# Altium project Wenzel_REF.PrjPCB (part 2 of 7)

## Sheet Clock_Generator_Divider.SchDoc: =SheetTitle_Top
size 420 x 297 mm; Author: G.Kasprowicz; CompanyName: WUT ISE; DrawnBy: G.Kasprowicz; Organization: WUT ISE; Address1: PW ISE; Address2: Nowowiejska 15/19 00-665 Warsaw; Address3: gkasprow@gmail.com; Revision: 1.1; ModifiedBy: -; CheckedDate: -; Title2: Clock generator & Divider; DivGrp: WUT ISE; Designer: G.Kasprowicz; ModifiedDate: -; ProjectName: Sensor Box
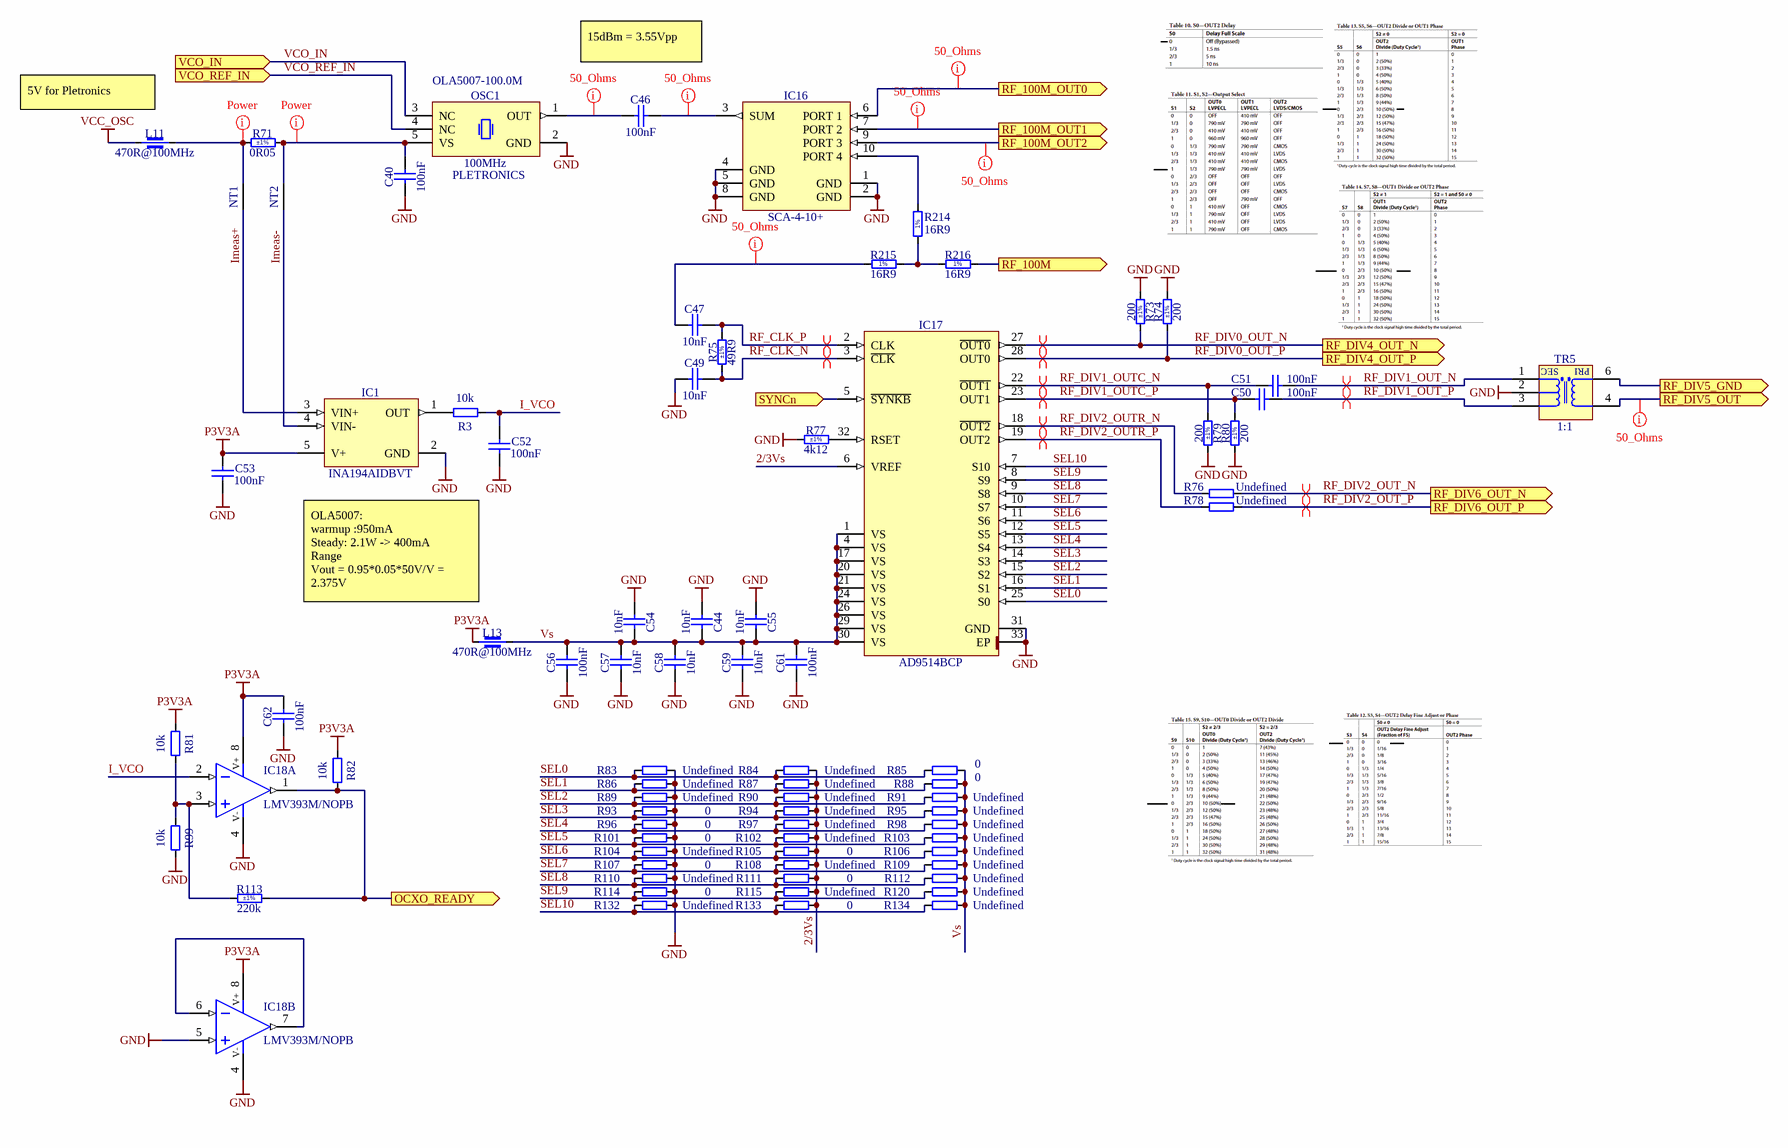
[diagram p3: Clock_Generator_Divider.SchDoc]

### Parts
(Parts that share a designator on the sheet are numbered #1, #2 ... from top to bottom, then left to right.)
C40  100nF  [CAPC1005X55N]
C44  10nF  [CAPC1005X55N]
C46  100nF  [CAPC1005X55N]
C47  10nF  [CAPC1005X55N]
C49  10nF  [CAPC1005X55N]
C50  100nF  [CAPC1005X55N]
C51  100nF  [CAPC1005X55N]
C52  100nF  [CAPC1005X55N]
C53  100nF  [CAPC1005X55N]
C54  10nF  [CAPC1005X55N]
C55  10nF  [CAPC1005X55N]
C56  100nF  [CAPC1005X55N]
C57  10nF  [CAPC1005X55N]
C58  10nF  [CAPC1005X55N]
C59  10nF  [CAPC1005X55N]
C61  100nF  [CAPC1005X55N]
C62  100nF  [CAPC1005X55N]
IC1  INA194AIDBVT  [SOT95P280X145-5N]
IC16  SCA-4-10+  [MINI-CIRCUITS_DZ943]
IC17  AD9514BCP  [QFN50P500X500X100-33N-S325]
IC18  LMV393M/NOPB  [SOIC127P600X175-8N]  (parts A,B of 2)
L11  470R@100MHz  [INDC1608X95N]
L13  470R@100MHz  [INDC1608X95N]
NT1  Net Tie  [Net Tie]  (value not drawn)  (net tie, no BOM)
NT2  Net Tie  [Net Tie]  (value not drawn)  (net tie, no BOM)
OSC1  100MHz  Manufacturer: PLETRONICS  Manufacturer Part Number: OLA5007-100.0M  [OSC_PLETRONICS_OLA5]
R3  10k  [RESC1608X55N]
R71  0R05  Tolerance: ±1%  [RESC2012X60N]
R73  200  Tolerance: ±1%  [RESC1005X40N]
R74  200  Tolerance: ±1%  [RESC1005X40N]
R75  49R9  Tolerance: ±1%  [RESC1005X40N]
R76  Undefined  [RESC1608X55N]
R77  4k12  Tolerance: ±1%  [RESC1005X40N]
R78  Undefined  [RESC1608X55N]
R79  200  Tolerance: ±1%  [RESC1005X40N]
R80  200  Tolerance: ±1%  [RESC1005X40N]
R81  10k  [RESC1608X55N]
R82  10k  [RESC1608X55N]
R83  Undefined  [RESC1608X55N]
R84  Undefined  [RESC1608X55N]
R85  0  [RESC1608X55N]
R86  Undefined  [RESC1608X55N]
R87  Undefined  [RESC1608X55N]
R88  0  [RESC1608X55N]
R89  Undefined  [RESC1608X55N]
R90  Undefined  [RESC1608X55N]
R91  Undefined  [RESC1608X55N]
R93  0  [RESC1608X55N]
R94  Undefined  [RESC1608X55N]
R95  Undefined  [RESC1608X55N]
R96  0  [RESC1608X55N]
R97  Undefined  [RESC1608X55N]
R98  Undefined  [RESC1608X55N]
R99  10k  [RESC1608X55N]
R101  0  [RESC1608X55N]
R102  Undefined  [RESC1608X55N]
R103  Undefined  [RESC1608X55N]
R104  Undefined  [RESC1608X55N]
R105  0  [RESC1608X55N]
R106  Undefined  [RESC1608X55N]
R107  0  [RESC1608X55N]
R108  Undefined  [RESC1608X55N]
R109  Undefined  [RESC1608X55N]
R110  Undefined  [RESC1608X55N]
R111  0  [RESC1608X55N]
R112  Undefined  [RESC1608X55N]
R113  220k  Tolerance: ±1%  [RESC1005X40N]
R114  0  [RESC1608X55N]
R115  Undefined  [RESC1608X55N]
R120  Undefined  [RESC1608X55N]
R132  Undefined  [RESC1608X55N]
R133  0  [RESC1608X55N]
R134  Undefined  [RESC1608X55N]
R214#1  16R9  [RESC1005X40N]
R215#1  16R9  [RESC1005X40N]
R216#1  16R9  [RESC1005X40N]
TR5  1:1  [XFMR_MINI-CIRCUITS_AT1521]

### Ports
OCXO_READY (out), RF_100M (out), RF_100M_OUT0 (out), RF_100M_OUT1 (out), RF_100M_OUT2 (out), RF_DIV4_OUT_N (out), RF_DIV4_OUT_P (out), RF_DIV5_GND (out), RF_DIV5_OUT (out), RF_DIV6_OUT_N (out), RF_DIV6_OUT_P (out), SYNCn (in), VCO_IN (in), VCO_REF_IN (in)

### Nets
GND: C40.1 C44.1 C49.1 C52.1 C53.1 C54.1 C55.1 C56.1 C57.1 C58.1 C59.1 C61.1 C62.1 IC1.2(GND) IC16.1(GND) IC16.2(GND) IC16.4(GND) IC16.5(GND) IC16.8(GND) IC17.31(GND) IC17.33(EP) IC18.4(V-) IC18.5(IN+) OSC1.2(GND) R73.1 R74.2 R77.1 R79.2 R80.1 R83.2 R86.2 R89.2 R93.2 R96.2 R99.2 R101.2 R104.2 R107.2 R110.2 R114.2 R132.2 TR5.2(NC)
P3V3A: C53.2 C62.2 IC1.5(V+) IC18.8(V+) L13.1 R81.1 R82.1
VCC_OSC: L11.1
2/3Vs: IC17.6(VREF) R84.2 R87.2 R90.2 R94.2 R97.2 R102.2 R105.2 R108.2 R111.2 R115.2 R133.2
D2: IC17.5(~{SYNKB}) ; port SYNCn
D3: IC18.1(OUT) R82.2 R113.2 ; port OCXO_READY
I_VCO: C52.2 IC18.2(IN-) R3.1
Imeas+: IC1.3(VIN+) NT1.1
Imeas-: IC1.4(VIN-) NT2.1
RF_100M: R216#1.2 ; port RF_100M
RF_100M_OUT0: IC16.6(PORT_1) ; port RF_100M_OUT0
RF_100M_OUT1: IC16.7(PORT_2) ; port RF_100M_OUT1
RF_100M_OUT2: IC16.9(PORT_3) ; port RF_100M_OUT2
RF_CLK_N: C49.2 IC17.3(~{CLK}) R75.1
RF_CLK_P: C47.2 IC17.2(CLK) R75.2
RF_DIV0_OUT_N: IC17.27(~{OUT0}) R73.2 ; port RF_DIV4_OUT_N  [project net IN_CLK0_N]
RF_DIV0_OUT_P: IC17.28(OUT0) R74.1 ; port RF_DIV4_OUT_P  [project net IN_CLK0_P]
RF_DIV1_OUT_N: C51.1 TR5.1(SDOT)
RF_DIV1_OUT_P: C50.1 TR5.3(S)
RF_DIV1_OUTC_N: C51.2 IC17.22(~{OUT1}) R79.1
RF_DIV1_OUTC_P: C50.2 IC17.23(OUT1) R80.2
RF_DIV2_OUT_N: R76.2 ; port RF_DIV6_OUT_N  [project net EEM_IO.LVDS_N0]
RF_DIV2_OUT_P: R78.2 ; port RF_DIV6_OUT_P  [project net EEM_IO.LVDS_P0]
RF_DIV2_OUTR_N: IC17.18(~{OUT2}) R76.1
RF_DIV2_OUTR_P: IC17.19(OUT2) R78.1
RF_DIV5_GND: TR5.6(PDOT) ; port RF_DIV5_GND
RF_DIV5_OUT: TR5.4(P) ; port RF_DIV5_OUT
SEL0: IC17.25(S0) R83.1 R84.1 R85.1
SEL1: IC17.16(S1) R86.1 R87.1 R88.1
SEL2: IC17.15(S2) R89.1 R90.1 R91.1
SEL3: IC17.14(S3) R93.1 R94.1 R95.1
SEL4: IC17.13(S4) R96.1 R97.1 R98.1
SEL5: IC17.12(S5) R101.1 R102.1 R103.1
SEL6: IC17.11(S6) R104.1 R105.1 R106.1
SEL7: IC17.10(S7) R107.1 R108.1 R109.1
SEL8: IC17.9(S8) R110.1 R111.1 R112.1
SEL9: IC17.8(S9) R114.1 R115.1 R120.1
SEL10: IC17.7(S10) R132.1 R133.1 R134.1
VCO_IN: OSC1.3(NC) ; port VCO_IN
VCO_REF_IN: OSC1.4(NC) ; port VCO_REF_IN
Vs: C44.2 C54.2 C55.2 C56.2 C57.2 C58.2 C59.2 C61.2 IC17.1(VS) IC17.4(VS) IC17.17(VS) IC17.20(VS) IC17.21(VS) IC17.24(VS) IC17.26(VS) IC17.29(VS) IC17.30(VS) L13.2 R85.2 R88.2 R91.2 R95.2 R98.2 R103.2 R106.2 R109.2 R112.2 R120.2 R134.2
NetC40_2: C40.2 NT2.2 OSC1.5(VS) R71.2
NetC46_1: C46.1 OSC1.1(OUT)
NetC46_2: C46.2 IC16.3(SUM)
NetC47_1: C47.1 R215#1.1
NetIC1_1: IC1.1(OUT) R3.2
NetIC16_10: IC16.10(PORT_4) R214#1.2
NetIC17_32: IC17.32(RSET) R77.2
NetIC18_3: IC18.3(IN+) R81.2 R99.1 R113.1
NetIC18_6: IC18.6(IN-) IC18.7(OUT)
NetL11_2: L11.2 NT1.2 R71.1
NetR214#1_1: R214#1.1 R215#1.2 R216#1.1

### Layout directives
net class 50_Ohms: NetC46_1, NetC46_2, NetC47_1, RF_100M_OUT0, RF_100M_OUT1, RF_100M_OUT2, RF_DIV5_OUT
net class Power: NetC40_2, NetL11_2
differential pair: EEM_IO.LVDS_N0, EEM_IO.LVDS_P0, IN_CLK0_N, IN_CLK0_P, RF_CLK_N, RF_CLK_P, RF_DIV1_OUT_N, RF_DIV1_OUT_P, RF_DIV1_OUTC_N, RF_DIV1_OUTC_P, RF_DIV2_OUTR_N, RF_DIV2_OUTR_P

### Notes on the sheet
- 15dBm = 3.55Vpp
- (near L11) 5V for Pletronics
- OLA5007:
  warmup :950mA
  Steady: 2.1W -> 400mA
  Range
  Vout = 0.95*0.05*50V/V = 2.375V
- Project/Equipment
- Document
- Designer
- Drawn by
- Check.by
- Copyright WUT ISE 2020.
  This documentation describes Open Hardware and is licensed under the CERN OHL v.1.2. You may redistribute and modify this documentation under the terms of the CERN OHL v.1.2. (http://ohwr.org/CERNOHL). This documentation is distributed WITHOUT ANY EXPRESS OR IMPLIED WARRANTY, INCLUDING OF MERCHANTABILITY, SATISFACTORY QUALITY AND FITNESS FOR A PARTICULAR PURPOSE. Please see the CERN OHL v.1.2 for applicable conditions.
- Contact
- File
- Last Mod.
- Print Date
- Sheet
- Size
- A3
- of
- Rev
- (in symbol R0402_16R9_1%_0.0625W_100PPM) 1%
- (in symbol XFMR_MINI-CIRCUITS_TC2-1TX+) SEC; PRI

### Library data of the parts
C40 C46 C50-C53 C56 C61 C62 = CC0402_100NF_16V_10%_X5R: as C41 on sheet Drivers; Part Number: CC0402_100NF_16V_10%_X5R; Component Kind: Standard; Component Type: Standard; Pin Count: 2; Value: 100nF; Status: None; Manufacturer Part Number: CC0402_100NF_16V_10%_X5R; Case: 0402; Mounted: Yes; Socket: No; SMD: Yes; Sense: No; Manufacturer1 Example: MURATA; Manufacturer1 ComponentHeight: 0.55mm; HelpURL: \\cern.ch\dfs\Applications\Altium\Datasheets\CC0402_X5R_MURATA_GRM.pdf; Author: CERN DEM JLC; CreateDate: 10.12.2013; LatestRevisionDate: 10.12.2013
C44 C47 C49 C54 C55 C57-C59 = CC0402_10NF_16V_10%_X7R: as C140#1 on sheet Wenzel_REF; Part Number: CC0402_10NF_16V_10%_X7R; Component Kind: Standard; Component Type: Standard; Pin Count: 2; Value: 10nF; Status: Not Recommended; Manufacturer Part Number: CC0402_10NF_16V_10%_X7R; Case: 0402; Mounted: Yes; Socket: No; SMD: Yes; Sense: No; Manufacturer1 Example: PHYCOMP; Manufacturer1 ComponentHeight: 0.55mm; HelpURL: \\cern.ch\dfs\Applications\Altium\Datasheets\CC0402_X7R_PHYCOMP.pdf; Author: CERN DEM JLC; CreateDate: 03.12.2007; LatestRevisionDate: 03.12.2007
IC1 = INA194AIDBVT: Current Shunt Monitor -16V to +80V Common-Mode Range; Manufacturer: TEXAS INSTRUMENTS; PressFit: No; Bonding: No; Part Number: INA194AIDBVT; Component Kind: Standard; Component Type: Standard; Device: INA194AIDBVT; PackageDescription: SOT, 0.95mm pitch; 5 pin, 1.60mm W X 2.90mm L X 1.45mm H body, IPC Medium Density; Part Description: Current Shunt Monitor -16V to +80V Common-Mode Range; Manufacturer Part Number: INA194AIDBVT; Pin Count: 5; Case: SOT23-5; Mounted: Yes; Socket: No; SMD: Yes; Sense: No; ComponentHeight: 1.45mm; Author: CERN DEM JLC; HelpURL: \\cern.ch\dfs\Applications\Altium\Datasheets\INA194AIDBVT.pdf; CreateDate: 10.05.2010; LatestRevisionDate: 10.05.2010
IC16 = SCA-4-10+: 4 Way-0°, 50 Ohms, 5 to 1000MHz, Power Splitter/Combiner; Manufacturer: MINI-CIRCUITS; PressFit: No; Bonding: No; Part Number: SCA-4-10+; Component Kind: Standard; Component Type: Standard; Device: SCA-4-10+; PackageDescription: MINI-CIRCUITS TDZ943 Case, 10 Pin,  7.62mm W X 6.35mm L; Part Description: 4 Way-0°, 50 Ohms, 5 to 1000MHz, Power Splitter/Combiner; Manufacturer Part Number: SCA-4-10; Pin Count: 10; Mounted: Yes; Socket: No; SMD: Yes; Sense: No; ComponentHeight: 5.84mm; Author: CERN DEM JLC; HelpURL: \\cern.ch\dfs\Applications\Altium\Datasheets\SCA-4-10+.pdf; CreateDate: 03.11.2009; LatestRevisionDate: 09.06.2022
IC17 = AD9514BCP: 1.600 MHz Clock distribution IC, dividers, Delay Adjust, Three Outputs; Part Description: 1.6 GHz Clock Distribution IC, dividers, Delay Adjust, three Outputs; Manufacturer: ANALOG DEVICES; PressFit: No; Bonding: No; Part Number: AD9514BCP; Component Kind: Standard; Component Type: Standard; Device: AD9514BCP; PackageDescription: QFN, (MO-220-VHHD-2) 0.50mm Pitch, Square; 32 Pin, 5.00mm L X 5.00mm W X 1.00mm H body (w/Thermal Tab 3.25 X 3.25mm), IPC Medium Density; Manufacturer Part Number: AD9514BCP; Pin Count: 33; Case: QFN32; Mounted: Yes; Socket: No; SMD: Yes; Sense: No; ComponentHeight: 1mm; HelpURL: \\cern.ch\dfs\Applications\Altium\Datasheets\AD9514BCP.pdf; Author: CERN DEM HF; CreateDate: 20.12.2023; LatestRevisionDate: 20.12.2023
IC18 = LMV393M/NOPB: Dual Operational Amplifier; Part Description: Dual General Purpose, Low Voltage, Tiny Pack Comparator; Manufacturer: TEXAS INSTRUMENTS; PressFit: No; Bonding: No; Part Number: LMV393M/NOPB; Component Kind: Standard; Component Type: Standard; Device: LMV393M/NOPB; PackageDescription: SOIC 8, Pitch 1.27mm - Body 4x5mm, IPC Medium Density; Manufacturer Part Number: LMV393M; Pin Count: 8; Case: SOIC8; Mounted: Yes; Socket: No; SMD: Yes; Sense: No; ComponentHeight: 1.75mm; Author: CERN DEM JLC; HelpURL: \\cern.ch\dfs\Applications\Altium\Datasheets\LMV393M-NOPB.pdf; CreateDate: 29.11.2012; LatestRevisionDate: 01.06.2022
L11 L13 = IND0603_MURATA_BLM18PG471SN1D: as L9 on sheet Clock_fanout; Part Number: IND0603_MURATA_BLM18PG471SN1D; Component Kind: Standard; Component Type: Standard; Pin Count: 2; Value: 470R@100MHz; Manufacturer Part Number: BLM18PG471SN1D; Case: 0603; Mounted: Yes; Socket: No; SMD: Yes; Sense: No; ComponentHeight: 0.95mm; HelpURL: \\cern.ch\dfs\Applications\Altium\Datasheets\IND0603_MURATA_BLM18P.pdf; Author: CERN DEM BC; CreateDate: 17.02.2021; LatestRevisionDate: 17.02.2021
NT1 NT2 = Net Tie: Part Description: Net Tie (2 Nets); Mounted: No; Part Number: Net Tie; Component Type: Net Tie; Pin Count: 2; Family: Net Tie; Socket: No; SMD: No; Sense: No; Status: None; ComponentHeight: 0mm; HelpURL: Undefined; Author: CERN DEM JLC; CreateDate: 22.03.2011; LatestRevisionDate: 22.03.2011; PackageDescription: 2 Plated Through Hole For Coaxial Cable Link: Hole Dia.=1.4mm Pad Dia.=2.5mm
OSC1 = OSC_100MHZ_PLETRONICS_OLA5007-100.0M: 12V ±0.05ppm Oven Controlled Crystal Oscillator OCXO; Part Description: 5V, Stability: ±50ppb, -40°C to +85°C, Ultra Low Phase Noise OCXO, OLA5 Series; PressFit: No; Bonding: No; Part Number: OSC_100MHZ_PLETRONICS_OLA5007-100.0M; Component Kind: Standard; Component Type: Standard; PackageDescription: Oscillator, 9.525mm Pitch; 5 Pin, 25.78mm L X 25.78mm W X 12.70mm H, OLA5 Series; Value: 100MHz; Pin Count: 5; Mounted: Yes; Socket: No; SMD: No; Sense: No; ComponentHeight: 12.7mm; HelpURL: \\cern.ch\dfs\Applications\Altium\Datasheets\OSC_PLETRONICS_OLA5.pdf; Author: CERN DEM HF; CreateDate: 21.12.2023; LatestRevisionDate: 21.12.2023
R3 R81 R82 R99 = R0603_10K_1%_0.1W_100PPM: Resistor - 1%; Part Description: General Purpose Thick Film Chip Resistor; Manufacturer: GENERIC; Manufacturer1 Part Number: NRC06F1002TRF; Power: 0.1W; TC: ±100ppm/°C; PressFit: No; Part Number: R0603_10K_1%_0.1W_100PPM; Component Kind: Standard; Component Type: Standard; Pin Count: 2; Value: 10k; Status: Preferred; Tolerance: ±1%; Manufacturer Part Number: R0603_10K_1%_0.1W_100PPM; Case: 0603; Mounted: Yes; Sense: No; Socket: No; SMD: Yes; Manufacturer1 Example: NIC COMPONENT; Manufacturer1 ComponentHeight: 0.55mm; HelpURL: \\cern.ch\dfs\Applications\Altium\Datasheets\R0603_NIC_NRC.pdf; Author: CERN DEM JLC; CreateDate: 03.12.2007; LatestRevisionDate: 13.03.2008
R71 = R0805_0R05_1%_0.25W_300PPM: Resistor - 1%; Part Description: Low Resistance Thick Film Chip Resistor; Manufacturer: GENERIC; Manufacturer1 Part Number: 235051117500L or RL0805FR-7W0R05L; Power: 0.25W; TC: ±300ppm/°C; PressFit: No; Part Number: R0805_0R05_1%_0.25W_300PPM; Component Kind: Standard; Component Type: Standard; Pin Count: 2; Value: 0R05; Status: Not Recommended; Manufacturer Part Number: R0805_0R05_1%_0.25W_300PPM; Case: 0805; Mounted: Yes; Sense: No; Socket: No; SMD: Yes; Manufacturer1 Example: YAGEO PHYCOMP; Manufacturer1 ComponentHeight: 0.60mm; HelpURL: \\cern.ch\dfs\Applications\Altium\Datasheets\R0805_Phycomp_RL0805.pdf; Author: CERN DEM MR; CreateDate: 31.03.2016; LatestRevisionDate: 31.03.2016
R73 R74 R79 R80 = R0402_200R_1%_0.0625W_100PPM: as R92 on sheet Wenzel_REF; Part Number: R0402_200R_1%_0.0625W_100PPM; Component Kind: Standard; Component Type: Standard; Pin Count: 2; Value: 200; Status: Not Recommended; Power: 0.0625W; Manufacturer Part Number: R0402_200R_1%_0.0625W_100PPM; Case: 0402; Mounted: Yes; Sense: No; Socket: No; SMD: Yes; Manufacturer1 Example: YAGEO PHYCOMP; Manufacturer1 ComponentHeight: 0.4mm; HelpURL: \\cern.ch\dfs\Applications\Altium\Datasheets\R0402_Phycomp_RC0402.pdf; Author: CERN DEM JLC; CreateDate: 03.12.2007; LatestRevisionDate: 17.10.2012
R75 = R0402_49R9_1%_0.0625W_100PPM: Resistor - 1%; Part Description: General Purpose Thick Film Chip Resistor; Manufacturer: GENERIC; Manufacturer1 Part Number: 232270674999L or RC0402FR-0749R9L; TC: ±100ppm/°C; PressFit: No; Part Number: R0402_49R9_1%_0.0625W_100PPM; Component Kind: Standard; Component Type: Standard; Pin Count: 2; Value: 49R9; Status: Not Recommended; Power: 0.0625W; Manufacturer Part Number: R0402_49R9_1%_0.0625W_100PPM; Case: 0402; Mounted: Yes; Sense: No; Socket: No; SMD: Yes; Manufacturer1 Example: YAGEO PHYCOMP; Manufacturer1 ComponentHeight: 0.4mm; HelpURL: \\cern.ch\dfs\Applications\Altium\Datasheets\R0402_Phycomp_RC0402.pdf; Author: CERN DEM JLC; CreateDate: 24.10.2012; LatestRevisionDate: 24.10.2012
R76 R78 R83 R84 R86 R87 R89-R91 R94 R95 R97 R98 R102-R104 R106 R108-R110 R112 R115 R120 R132 R134 = R0603_NO-VALUE: as R168 on sheet Wenzel_REF; Part Number: R0603_NO-VALUE; Component Kind: Standard; Component Type: Standard; Pin Count: 2; Value: Undefined; Status: None; Manufacturer: Undefined; Manufacturer Part Number: R0603_NO-VALUE; Case: 0603; Sense: No; Socket: No; SMD: Yes; Manufacturer1 Example: Undefined; Manufacturer1 Part Number: Undefined; Manufacturer1 ComponentHeight: Undefined; HelpURL: Undefined; Author: CERN DEM JLC; CreateDate: 03.12.2007; LatestRevisionDate: 13.03.2008
R77 = R0402_4K12_1%_0.0625W_100PPM: Resistor - 1%; Part Description: General Purpose Thick Film Chip Resistor; Manufacturer: GENERIC; Manufacturer1 Part Number: 232270674122L or RC0402FR-074K12L; TC: ±100ppm/°C; PressFit: No; Part Number: R0402_4K12_1%_0.0625W_100PPM; Component Kind: Standard; Component Type: Standard; Pin Count: 2; Value: 4k12; Status: Not Recommended; Power: 0.0625W; Manufacturer Part Number: R0402_4K12_1%_0.0625W_100PPM; Case: 0402; Mounted: Yes; Sense: No; Socket: No; SMD: Yes; Manufacturer1 Example: YAGEO PHYCOMP; Manufacturer1 ComponentHeight: 0.4mm; HelpURL: \\cern.ch\dfs\Applications\Altium\Datasheets\R0402_Phycomp_RC0402.pdf; Author: CERN DEM JLC; CreateDate: 24.10.2012; LatestRevisionDate: 24.10.2012
R85 R88 R93 R96 R101 R105 R107 R111 R114 R133 = R0603_0R_JUMPER: Resistor; Part Description: 1A (0.05R Max DC Resistance) Zero Ohm Jumper; Manufacturer: GENERIC; Manufacturer1 Part Number: NRC06Z0; PressFit: No; Part Number: R0603_0R_JUMPER; Component Kind: Standard; Component Type: Standard; Pin Count: 2; Value: 0; Status: Preferred; Manufacturer Part Number: R0603_0R_JUMPER; Case: 0603; Mounted: Yes; Sense: No; Socket: No; SMD: Yes; Manufacturer1 Example: NIC COMPONENT; Manufacturer1 ComponentHeight: 0.55mm; HelpURL: \\cern.ch\dfs\Applications\Altium\Datasheets\R0603_NIC_NRC.pdf; Author: CERN DEM JLC; CreateDate: 03.12.2007; LatestRevisionDate: 13.03.2008
R113 = R0402_220K_1%_0.0625W_100PPM: Resistor - 1%; Part Description: General Purpose Thick Film Chip Resistor; Manufacturer: GENERIC; Manufacturer1 Part Number: 232270672204L; TC: ±100ppm/°C; PressFit: No; Part Number: R0402_220K_1%_0.0625W_100PPM; Component Kind: Standard; Component Type: Standard; Pin Count: 2; Value: 220k; Status: Not Recommended; Power: 0.0625W; Manufacturer Part Number: R0402_220K_1%_0.0625W_100PPM; Case: 0402; Mounted: Yes; Sense: No; Socket: No; SMD: Yes; Manufacturer1 Example: YAGEO PHYCOMP; Manufacturer1 ComponentHeight: 0.4mm; HelpURL: \\cern.ch\dfs\Applications\Altium\Datasheets\R0402_Phycomp_RC0402.pdf; Author: CERN DEM JLC; CreateDate: 03.12.2007; LatestRevisionDate: 17.10.2012
R214#1 R215#1 R216#1 = R0402_16R9_1%_0.0625W_100PPM: Resistor - 1%; Part Description: General Purpose Thick Film Chip Resistor; Manufacturer: GENERIC; Manufacturer1 Part Number: CRCW040216R9FKED; TC: ±100ppm/°C; PressFit: No; Part Number: R0402_16R9_1%_0.0625W_100PPM; Component Kind: Standard; Component Type: Standard; Pin Count: 2; Value: 16R9; Status: None; Power: 0.0625W; Tolerance: ±1%; Manufacturer Part Number: R0402_16R9_1%_0.0625W_100PPM; Case: 0402; Mounted: Yes; Sense: No; Socket: No; SMD: Yes; Manufacturer1 Example: VISHAY; Manufacturer1 ComponentHeight: 0.4mm; HelpURL: \\cern.ch\dfs\Applications\Altium\Datasheets\R0402_VISHAY_CRCW e3.pdf; Author: CERN DEM JLC; CreateDate: 15/02/2018; LatestRevisionDate: 15/02/2018
TR5 = XFMR_MINI-CIRCUITS_TC2-1TX+: 50 Ohms 3 to 300MHz RF Transformer; Part Number: XFMR_MINI-CIRCUITS_TC2-1TX+; Component Kind: Standard; Component Type: Standard; Pin Count: 5; Value: 1:1; Status: None; Part Description: 50 Ohms 3 to 300MHz RF Transformer; Manufacturer: MINI-CIRCUITS; Manufacturer Part Number: TC2-1TX+; Mounted: Yes; Socket: No; Sense: No; SMD: Yes; ComponentHeight: 4.06mm; HelpURL: \\cern.ch\dfs\Applications\Altium\Datasheets\XFMR_MINI-CIRCUITS_TC2-1TX+.pdf; Author: CERN DEM MR; CreateDate: 18.10.2019; LatestRevisionDate: 18.10.2019

## Sheet Shield_Connectors.SchDoc: =SheetTitle_Top
size 420 x 297 mm; Author: G.Kasprowicz; CompanyName: WUT ISE; DrawnBy: G.Kasprowicz; Organization: WUT ISE; Address1: PW ISE; Address2: Nowowiejska 15/19 00-665 Warsaw; Address3: gkasprow@gmail.com; Revision: 1.1; ModifiedBy: -; CheckedDate: -; Title2: SPEC-A7 / GPSDO connectors; DivGrp: WUT ISE; Designer: G.Kasprowicz; ModifiedDate: -; ProjectName: Sensor Box
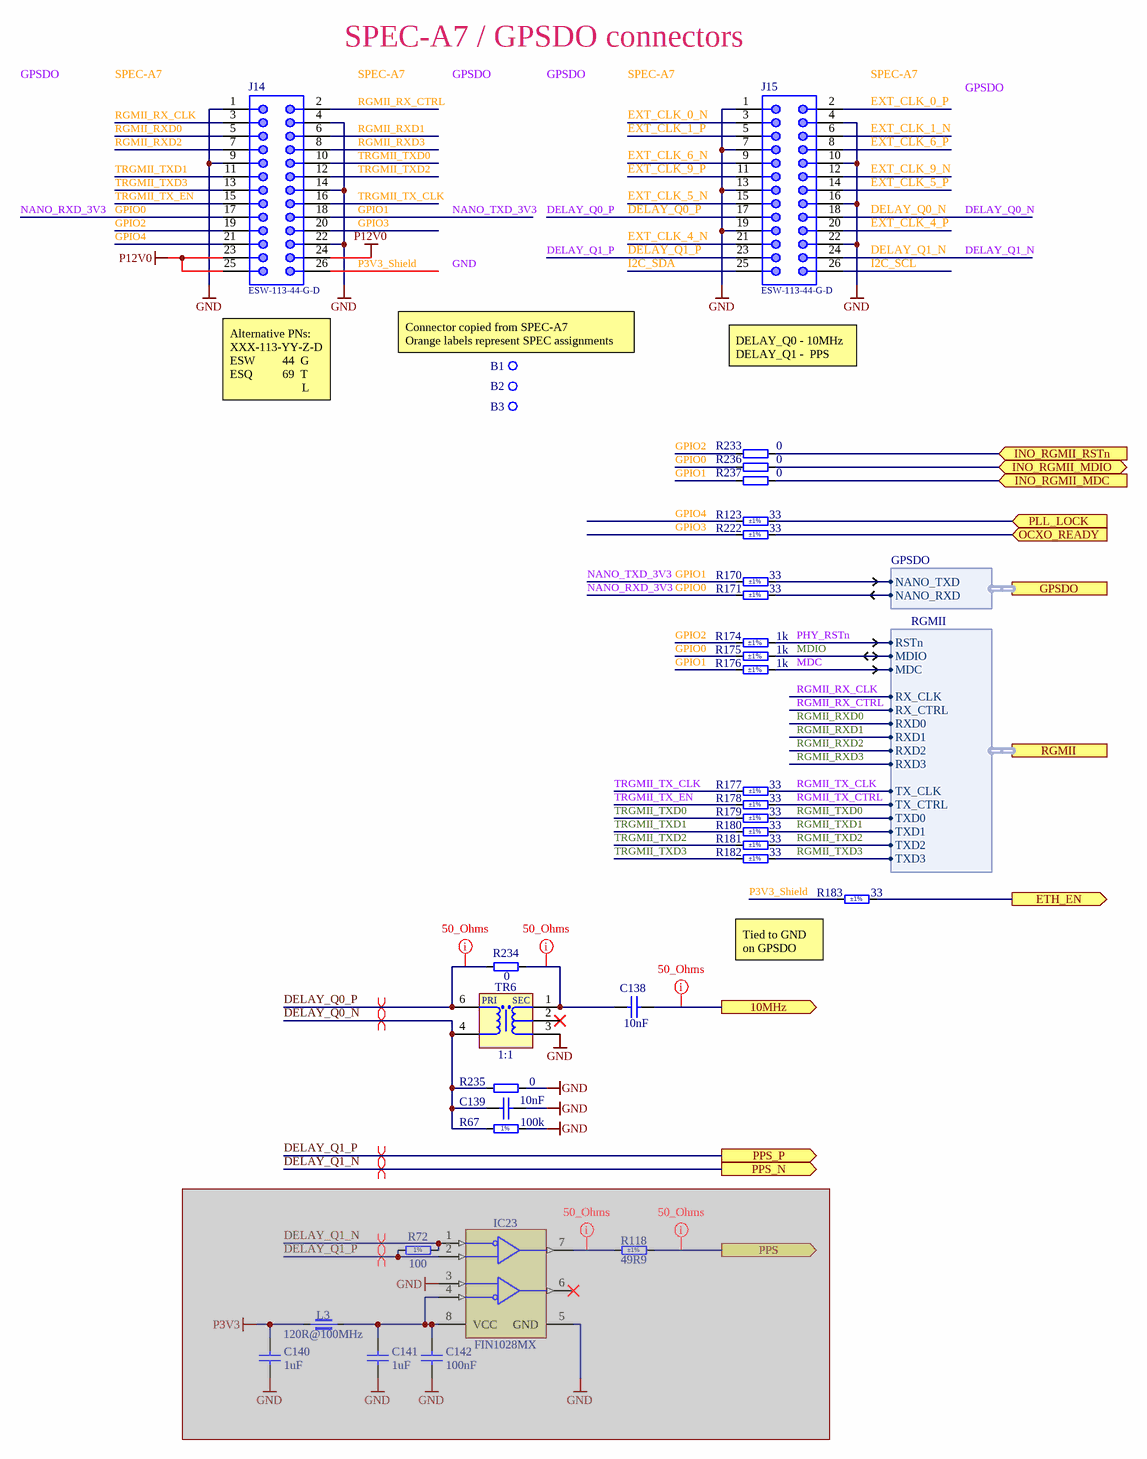
[diagram p4: Shield_Connectors.SchDoc]

### Parts
(Parts that share a designator on the sheet are numbered #1, #2 ... from top to bottom, then left to right.)
B1  Non Plated Hole  [MTG400]  (value not drawn)  (no BOM)
B2  Non Plated Hole  [MTG400]  (value not drawn)  (no BOM)
B3  Non Plated Hole  [MTG400]  (value not drawn)  (no BOM)
C138  10nF  [CAPC1005X55N]
C139  10nF  [CAPC1005X55N]
C140#2  1uF  [CAPC1608X87N]  (masked out: inside a compile mask, not in the netlist)
C141#1  1uF  [CAPC1608X87N]  (masked out: inside a compile mask, not in the netlist)
C142#1  100nF  [CAPC1005X55N]  (masked out: inside a compile mask, not in the netlist)
IC23#1  FIN1028MX  [SOIC127P600X175-8N]  (masked out: inside a compile mask, not in the netlist)
J14  ESW-113-44-G-D  [ESW-113-44-G-D]
J15  ESW-113-44-G-D  [ESW-113-44-G-D]
L3#1  120R@100MHz  [INDC1608X65N]  (masked out: inside a compile mask, not in the netlist)
R67#1  100k  [RESC1005X40N]
R72#2  100  [RESC1005X40N]  (masked out: inside a compile mask, not in the netlist)
R118#2  49R9  Tolerance: ±1%  [RESC1005X40N]  (masked out: inside a compile mask, not in the netlist)
R123#1  33  Tolerance: ±1%  [RESC1005X40N]
R170  33  Tolerance: ±1%  [RESC1005X40N]
R171  33  Tolerance: ±1%  [RESC1005X40N]
R174  1k  Tolerance: ±1%  [RESC1005X40N]
R175  1k  Tolerance: ±1%  [RESC1005X40N]
R176  1k  Tolerance: ±1%  [RESC1005X40N]
R177  33  Tolerance: ±1%  [RESC1005X40N]
R178  33  Tolerance: ±1%  [RESC1005X40N]
R179  33  Tolerance: ±1%  [RESC1005X40N]
R180  33  Tolerance: ±1%  [RESC1005X40N]
R181  33  Tolerance: ±1%  [RESC1005X40N]
R182  33  Tolerance: ±1%  [RESC1005X40N]
R183  33  Tolerance: ±1%  [RESC1005X40N]
R222  33  Tolerance: ±1%  [RESC1005X40N]
R233  0  [RESC1005X40N]
R234  0  [RESC1005X40N]
R235  0  [RESC1608X55N]
R236  0  [RESC1005X40N]
R237  0  [RESC1005X40N]
TR6  1:1  [XFMR_MINI-CIRCUITS_AT1521]

### Ports
10MHz (out), ETH_EN (out), GPSDO (harness GPSDO), INO_RGMII_MDC (in), INO_RGMII_MDIO (bidir), INO_RGMII_RSTn (in), OCXO_READY (in), PLL_LOCK (in), PPS (out), PPS_N (out), PPS_P (out), RGMII (harness RGMII)

### Harnesses
RGMII: RSTn, MDIO, MDC, RX_CLK, RX_CTRL, RXD0, RXD1, RXD2, RXD3, TXD0, TXD1, TXD2, TXD3, TX_CTRL, TX_CLK
GPSDO: NANO_RXD, NANO_TXD

### Nets
GND: C139.1 J14.1 J14.4 J14.9 J14.14 J14.22 J15.1 J15.4 J15.7 J15.10 J15.13 J15.16 J15.19 J15.22 R67#1.2 R235.1 TR6.3(S)
P12V0: J14.23 J14.24 J14.25
10MHz: C138.1 ; port 10MHz
A2: R183.2 ; port ETH_EN
D3: R222.2 ; port OCXO_READY
D4: R123#1.2 ; port PLL_LOCK
D8: R233.1 ; port INO_RGMII_RSTn
D9: R236.1 ; port INO_RGMII_MDIO
D10: R237.1 ; port INO_RGMII_MDC
DELAY_Q0_N: C139.2 J15.18 R67#1.1 R235.2 TR6.4(P)
DELAY_Q0_P: J15.17 R234.1 TR6.6(PDOT)
DELAY_Q1_N: J15.24 ; port PPS_N
DELAY_Q1_P: J15.23 ; port PPS_P
EXT_CLK_0_N: J15.3
EXT_CLK_0_P: J15.2
EXT_CLK_1_N: J15.6
EXT_CLK_1_P: J15.5
EXT_CLK_4_N: J15.21
EXT_CLK_4_P: J15.20
EXT_CLK_5_N: J15.15
EXT_CLK_5_P: J15.14
EXT_CLK_6_N: J15.9
EXT_CLK_6_P: J15.8
EXT_CLK_9_N: J15.12
EXT_CLK_9_P: J15.11
GPIO0: J14.17 R171.1 R175.1 R236.2
GPIO1: J14.18 R170.1 R176.1 R237.2
GPIO2: J14.19 R174.1 R233.2
GPIO3: J14.20 R222.1
GPIO4: J14.21 R123#1.1
I2C_SCL: J15.26
I2C_SDA: J15.25
MDC: R176.2 ; port RGMII.MDC
MDIO: R175.2 ; port RGMII.MDIO
P3V3_Shield: J14.26 R183.1
PHY_RSTn: R174.2 ; port RGMII.RSTn
RGMII_RX_CLK: J14.3 ; port RGMII.RX_CLK
RGMII_RX_CTRL: J14.2 ; port RGMII.RX_CTRL
RGMII_RXD0: J14.5 ; port RGMII.RXD0
RGMII_RXD1: J14.6 ; port RGMII.RXD1
RGMII_RXD2: J14.7 ; port RGMII.RXD2
RGMII_RXD3: J14.8 ; port RGMII.RXD3
RGMII_TX_CLK: R177.2 ; port RGMII.TX_CLK
RGMII_TX_CTRL: R178.2 ; port RGMII.TX_CTRL
RGMII_TXD0: R179.2 ; port RGMII.TXD0
RGMII_TXD1: R180.2 ; port RGMII.TXD1
RGMII_TXD2: R181.2 ; port RGMII.TXD2
RGMII_TXD3: R182.2 ; port RGMII.TXD3
TRGMII_TX_CLK: J14.16 R177.1
TRGMII_TX_EN: J14.15 R178.1
TRGMII_TXD0: J14.10 R179.1
TRGMII_TXD1: J14.11 R180.1
TRGMII_TXD2: J14.12 R181.1
TRGMII_TXD3: J14.13 R182.1
NetC138_2: C138.2 R234.2 TR6.1(SDOT)
NetIC40_9: R171.2 ; port GPSDO.NANO_RXD
NetR14_1: R170.2 ; port GPSDO.NANO_TXD

Not connected (* = marked no-connect by the designer): B1 1; B2 1; B3 1; TR6 2(NC)*

### Layout directives
net class 50_Ohms: 10MHz, (no net found under the mark), DELAY_Q0_P, NetC138_2
differential pair: (no net found under the mark), DELAY_Q0_N, DELAY_Q0_P, DELAY_Q1_N, DELAY_Q1_P

### Notes on the sheet
- SPEC-A7 / GPSDO connectors
- GPSDO
- SPEC-A7
- NANO_RXD_3V3
- NANO_TXD_3V3
- DELAY_Q0_P
- DELAY_Q0_N
- GND
- DELAY_Q1_P
- DELAY_Q1_N
- (near B1) Connector copied from SPEC-A7
  Orange labels represent SPEC assignments
- DELAY_Q0 - 10MHz
  DELAY_Q1 -  PPS
- (near J14) Alternative PNs:
  XXX-113-YY-Z-D
  ESW         44  G
  ESQ          69  T
  L
- (near R183) Tied to GND on GPSDO
- Project/Equipment
- Document
- Designer
- Drawn by
- Check.by
- Copyright WUT ISE 2020.
  This documentation describes Open Hardware and is licensed under the CERN OHL v.1.2. You may redistribute and modify this documentation under the terms of the CERN OHL v.1.2. (http://ohwr.org/CERNOHL). This documentation is distributed WITHOUT ANY EXPRESS OR IMPLIED WARRANTY, INCLUDING OF MERCHANTABILITY, SATISFACTORY QUALITY AND FITNESS FOR A PARTICULAR PURPOSE. Please see the CERN OHL v.1.2 for applicable conditions.
- Contact
- File
- Last Mod.
- Print Date
- Sheet
- Size
- A3
- of
- Rev
- (in symbol R0402_100K_1%_0.0625W_100PPM) 1%
- (in symbol R0402_100R_1%_0.0625W_100PPM) 1%
- (in symbol XFMR_MINI-CIRCUITS_TC2-1TX+) PRI; SEC

### Library data of the parts
B1-B3 = NON-PLATED_HOLE4.0: Single Terminal Socket; Part Description: Non Plated Through Hole: Hole Dia.=4.0mm; Mounted: No; Part Number: NON-PLATED_HOLE4.0; Component Type: Standard (No BOM); Pin Count: 1; Family: Non Plated Hole; Socket: No; SMD: No; Sense: No; Status: None; ComponentHeight: 0mm; HelpURL: Undefined; Author: CERN DEM JMW; CreateDate: 22.03.2019; LatestRevisionDate: 22.03.2019; PackageDescription: Non Plated Through Hole: Hole Dia.=4.0mm
C138 C139 = CC0402_10NF_16V_10%_X7R: as C140#1 on sheet Wenzel_REF; Part Number: CC0402_10NF_16V_10%_X7R; Component Kind: Standard; Component Type: Standard; Pin Count: 2; Value: 10nF; Status: Not Recommended; Manufacturer Part Number: CC0402_10NF_16V_10%_X7R; Case: 0402; Mounted: Yes; Socket: No; SMD: Yes; Sense: No; Manufacturer1 Example: PHYCOMP; Manufacturer1 ComponentHeight: 0.55mm; HelpURL: \\cern.ch\dfs\Applications\Altium\Datasheets\CC0402_X7R_PHYCOMP.pdf; Author: CERN DEM JLC; CreateDate: 2007-12-03; LatestRevisionDate: 2007-12-03
C140#2 C141#1 = CC0603_1UF_25V_10%_X7R: Non-polarised capacitor; Part Description: SMD Multilayer Chip Ceramic Capacitor; Manufacturer: GENERIC; Manufacturer1 Part Number: GRM188R71E105KA12D; Voltage: 25V; TC: X7R; Tolerance: ±10%; Part Number: CC0603_1UF_25V_10%_X7R; Component Kind: Standard; Component Type: Standard; Pin Count: 2; Value: 1uF; Status: None; Manufacturer Part Number: CC0603_1UF_25V_10%_X7R; Case: 0603; Mounted: Yes; Socket: No; SMD: Yes; Sense: No; Manufacturer1 Example: MURATA; Manufacturer1 ComponentHeight: 0.9mm; HelpURL: \\cern.ch\dfs\Applications\Altium\Datasheets\CC0603_X7R_MURATA.pdf; Author: CERN DEM JLC; CreateDate: 18.01.2011; LatestRevisionDate: 18.01.2011
C142#1 = CC0402_100NF_16V_10%_X5R: as C41 on sheet Drivers; Part Number: CC0402_100NF_16V_10%_X5R; Component Kind: Standard; Component Type: Standard; Pin Count: 2; Value: 100nF; Status: None; Manufacturer Part Number: CC0402_100NF_16V_10%_X5R; Case: 0402; Mounted: Yes; Socket: No; SMD: Yes; Sense: No; Manufacturer1 Example: MURATA; Manufacturer1 ComponentHeight: 0.55mm; HelpURL: \\cern.ch\dfs\Applications\Altium\Datasheets\CC0402_X5R_MURATA_GRM.pdf; Author: CERN DEM JLC; CreateDate: 10.12.2013; LatestRevisionDate: 10.12.2013
IC23#1 = IFC_FIN1028: as IC5 on sheet Drivers; Part Number: FIN1028MX; Component Kind: Standard; Component Type: Standard; Device: FIN1028MX; PackageDescription: SOIC 8, Pitch 1.27mm - Body 4x5mm, IPC Medium Density; Part Description: 3.3V LVDS 2-Bit High-Speed Differential Reciever; Manufacturer Part Number: FIN1028MX; Pin Count: 8; Case: SOIC8; Mounted: Yes; Socket: No; SMD: Yes; Sense: No; ComponentHeight: 0.8mm; Author: GK; HelpURL: \\cern.ch\dfs\Applications\Altium\Datasheets\FIN1101K8X.pdf; CreateDate: 08/11/2016; LatestRevisionDate: 08/11/2016
J14 J15 = ESW-113-44-G-D: ESW-113-44-G-D Pin Header, THT, pitch 2.54mm, Dual Row, Vertical, 26pin; Manufacturer: Samtec; Pin Number: 26; Part Number: ESW-113-44-G-D; Publisher: Samtec; Pitch: 2.54mm; Mounting Technology: THT; Manufacturer Part Number: ESW-113-44-G-D
L3#1 = IND0603_MURATA_BLM18SG121TN1D: Part Description: SMD EMIFIL Suppression Chip Ferrite Bead; Manufacturer: MURATA; Power: 3A; Resistance: 0.025R; Tolerance: ±25%; Part Number: IND0603_MURATA_BLM18SG121TN1D; Component Kind: Standard; Component Type: Standard; Pin Count: 2; Value: 120R@100MHz; Manufacturer Part Number: BLM18SG121TN1D; Case: 0603; Mounted: Yes; Socket: No; SMD: Yes; Sense: No; ComponentHeight: 0.65mm; HelpURL: \\cern.ch\dfs\Applications\Altium\Datasheets\IND0603_MURATA_BLM18S.pdf; Author: CERN DEM JLC; CreateDate: 23.07.2014; LatestRevisionDate: 25.10.2018
R67#1 = R0402_100K_1%_0.0625W_100PPM: Resistor - 1%; Part Description: General Purpose Thick Film Chip Resistor; Manufacturer: GENERIC; Manufacturer1 Part Number: 232270671004L; PressFit: No; TC: ±100ppm/°C; Part Number: R0402_100K_1%_0.0625W_100PPM; Component Kind: Standard; Component Type: Standard; Pin Count: 2; Value: 100k; Status: Not Recommended; Manufacturer Part Number: R0402_100K_1%_0.0625W_100PPM; Case: 0402; Mounted: Yes; Sense: No; Socket: No; SMD: Yes; Manufacturer1 Example: YAGEO PHYCOMP; Manufacturer1 ComponentHeight: 0.4mm; HelpURL: \\cern.ch\dfs\Applications\Altium\Datasheets\R0402_Phycomp_RC0402.pdf; Author: CERN DEM JLC; CreateDate: 03.12.2007; LatestRevisionDate: 17.10.2012; Power: 0.0625W; Tolerance: ±1%
R72#2 = R0402_100R_1%_0.0625W_100PPM: as R14 on sheet Drivers; Part Number: R0402_100R_1%_0.0625W_100PPM; Component Kind: Standard; Component Type: Standard; Pin Count: 2; Value: 100; Status: Not Recommended; Power: 0.0625W; Tolerance: ±1%; Manufacturer Part Number: R0402_100R_1%_0.0625W_100PPM; Case: 0402; Mounted: Yes; Sense: No; Socket: No; SMD: Yes; Manufacturer1 Example: YAGEO PHYCOMP; Manufacturer1 ComponentHeight: 0.4mm; HelpURL: \\cern.ch\dfs\Applications\Altium\Datasheets\R0402_Phycomp_RC0402.pdf; Author: CERN DEM JLC; CreateDate: 03.12.2007; LatestRevisionDate: 17.10.2012
R118#2 = R0402_49R9_1%_0.0625W_100PPM: as R75 on sheet Clock_Generator_Divider; Part Number: R0402_49R9_1%_0.0625W_100PPM; Component Kind: Standard; Component Type: Standard; Pin Count: 2; Value: 49R9; Status: Not Recommended; Power: 0.0625W; Manufacturer Part Number: R0402_49R9_1%_0.0625W_100PPM; Case: 0402; Mounted: Yes; Sense: No; Socket: No; SMD: Yes; Manufacturer1 Example: YAGEO PHYCOMP; Manufacturer1 ComponentHeight: 0.4mm; HelpURL: \\cern.ch\dfs\Applications\Altium\Datasheets\R0402_Phycomp_RC0402.pdf; Author: CERN DEM JLC; CreateDate: 24.10.2012; LatestRevisionDate: 24.10.2012
R123#1 R170 R171 R177-R183 R222 = R0402_33R_1%_0.0625W_100PPM: Resistor - 1%; Part Description: General Purpose Thick Film Chip Resistor; Manufacturer: GENERIC; Manufacturer1 Part Number: 232270673309L; TC: ±100ppm/°C; PressFit: No; Part Number: R0402_33R_1%_0.0625W_100PPM; Component Kind: Standard; Component Type: Standard; Pin Count: 2; Value: 33; Status: Not Recommended; Power: 0.0625W; Manufacturer Part Number: R0402_33R_1%_0.0625W_100PPM; Case: 0402; Mounted: Yes; Sense: No; Socket: No; SMD: Yes; Manufacturer1 Example: YAGEO PHYCOMP; Manufacturer1 ComponentHeight: 0.4mm; HelpURL: \\cern.ch\dfs\Applications\Altium\Datasheets\R0402_Phycomp_RC0402.pdf; Author: CERN DEM JLC; CreateDate: 03.12.2007; LatestRevisionDate: 17.10.2012
R174-R176 = R0402_1K_1%_0.0625W_100PPM: Resistor - 1%; Part Description: General Purpose Thick Film Chip Resistor; Manufacturer: GENERIC; Manufacturer1 Part Number: 232270671002L; TC: ±100ppm/°C; PressFit: No; Part Number: R0402_1K_1%_0.0625W_100PPM; Component Kind: Standard; Component Type: Standard; Pin Count: 2; Value: 1k; Status: Not Recommended; Power: 0.0625W; Manufacturer Part Number: R0402_1K_1%_0.0625W_100PPM; Case: 0402; Mounted: Yes; Sense: No; Socket: No; SMD: Yes; Manufacturer1 Example: YAGEO PHYCOMP; Manufacturer1 ComponentHeight: 0.4mm; HelpURL: \\cern.ch\dfs\Applications\Altium\Datasheets\R0402_Phycomp_RC0402.pdf; Author: CERN DEM JLC; CreateDate: 03.12.2007; LatestRevisionDate: 17.10.2012
R233 R234 R236 R237 = R0402_0R_JUMPER: as R12 on sheet Wenzel_REF; Part Number: R0402_0R_JUMPER; Component Kind: Standard; Component Type: Standard; Pin Count: 2; Value: 0; Status: Not recommended; Manufacturer Part Number: R0402_0R_JUMPER; Case: 0402; Mounted: Yes; Sense: No; Socket: No; SMD: Yes; Manufacturer1 Example: YAGEO PHYCOMP; Manufacturer1 ComponentHeight: 0.4mm; HelpURL: \\cern.ch\dfs\Applications\Altium\Datasheets\R0402_Phycomp_RC0402.pdf; Author: CERN DEM JLC
  R233 R236 R237: CreateDate: 03.12.2007; LatestRevisionDate: 17.10.2012
  R234: CreateDate: 2007-12-03; LatestRevisionDate: 2012-10-17
R235 = R0603_0R_JUMPER: as R85 on sheet Clock_Generator_Divider; Part Number: R0603_0R_JUMPER; Component Kind: Standard; Component Type: Standard; Pin Count: 2; Value: 0; Status: Preferred; Manufacturer Part Number: R0603_0R_JUMPER; Case: 0603; Mounted: Yes; Sense: No; Socket: No; SMD: Yes; Manufacturer1 Example: NIC COMPONENT; Manufacturer1 ComponentHeight: 0.55mm; HelpURL: \\cern.ch\dfs\Applications\Altium\Datasheets\R0603_NIC_NRC.pdf; Author: CERN DEM JLC; CreateDate: 03.12.2007; LatestRevisionDate: 13.03.2008
TR6 = XFMR_MINI-CIRCUITS_TC2-1TX+: 50 Ohms 3 to 300MHz RF Transformer; Part Number: XFMR_MINI-CIRCUITS_TC2-1TX+; Component Kind: Standard; Component Type: Standard; Pin Count: 5; Value: 1:1; Status: None; Part Description: 50 Ohms 3 to 300MHz RF Transformer; Manufacturer: MINI-CIRCUITS; Manufacturer Part Number: TC2-1TX+; Mounted: Yes; Socket: No; Sense: No; SMD: Yes; ComponentHeight: 4.06mm; HelpURL: \\cern.ch\dfs\Applications\Altium\Datasheets\XFMR_MINI-CIRCUITS_TC2-1TX+.pdf; Author: CERN DEM MR; CreateDate: 18.10.2019; LatestRevisionDate: 18.10.2019